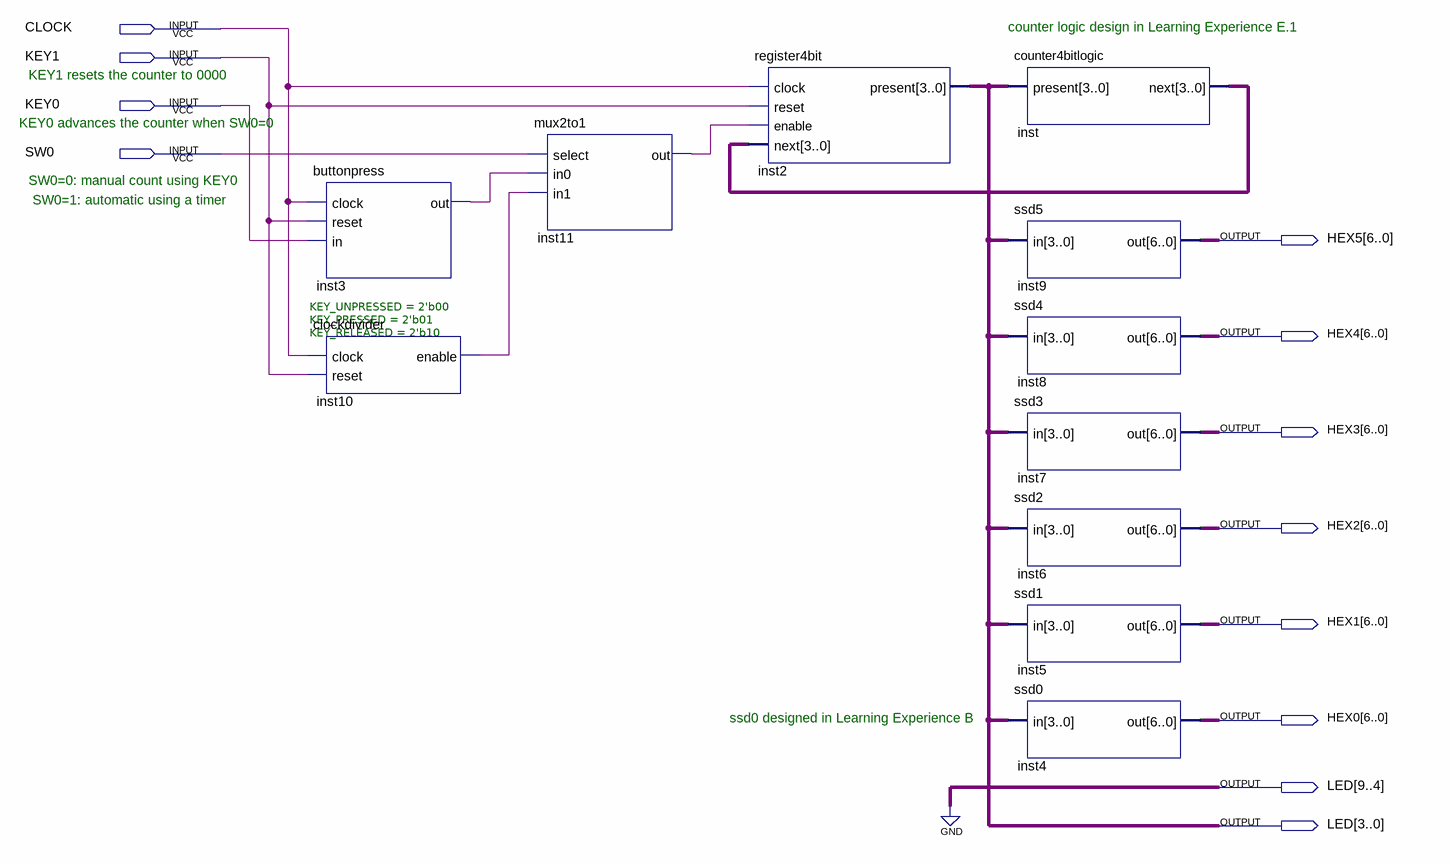
[diagram p0: schematic sheet]
// Quartus schematic sign.bdf as structural Verilog: 11 symbols, 12 pins
module sign (
  input  CLOCK,
  input  KEY1,
  input  KEY0,
  input  SW0,
  output [6:0] HEX5,
  output [6:0] HEX4,
  output [6:0] HEX3,
  output [6:0] HEX2,
  output [6:0] HEX1,
  output [6:0] HEX0,
  output [9:0] LED
);

  wire inst3_out, inst10_enable, inst11_out;
  wire [3:0] inst_next;

  buttonpress #(.KEY_UNPRESSED(2'b00), .KEY_PRESSED(2'b01), .KEY_RELEASED(2'b10)) inst3 (
    .clock(CLOCK), .reset(KEY1), .in(KEY0), .out(inst3_out));
  clockdivider inst10 (.clock(CLOCK), .reset(KEY1), .enable(inst10_enable));
  mux2to1 inst11 (.select(SW0), .in0(inst3_out), .in1(inst10_enable), .out(inst11_out));
  register4bit inst2 (.clock(CLOCK), .reset(KEY1), .enable(inst11_out), .next(inst_next), .present(LED[3:0]));
  counter4bitlogic inst (.present(LED[3:0]), .next(inst_next));
  ssd5 inst9 (.in(LED[3:0]), .out(HEX5));
  ssd4 inst8 (.in(LED[3:0]), .out(HEX4));
  ssd3 inst7 (.in(LED[3:0]), .out(HEX3));
  ssd2 inst6 (.in(LED[3:0]), .out(HEX2));
  ssd1 inst5 (.in(LED[3:0]), .out(HEX1));
  ssd0 inst4 (.in(LED[3:0]), .out(HEX0));

  assign LED[9:4] = {6{1'b0}};

  // Notes on the sheet:
  //   counter logic design in Learning Experience E.1
  //   KEY1 resets the counter to 0000
  //   KEY0 advances the counter when SW0=0
  //   SW0=0: manual count using KEY0
  //    SW0=1: automatic using a timer
  //   ssd0 designed in Learning Experience B
endmodule
